# EasyEDA Pro project ProProject_ESP32-Gateway_2023-11-02.epro, schematic Schematic1_1
Create Date: 2022-03-22; Page Name: P1; Project Name: YuToo墨水屏时钟; Schematic Name: Schematic1_1; Update Date: 2022-10-05; Add into BOM: yes; Company: 深圳嘉立创科技发展有限公司; Convert to PCB: yes; Drawed: 嘉立创EDA; Page Size: A3; Part Number: JLCPCB-001; Reviewed: 嘉立创EDA; Version: V0.1
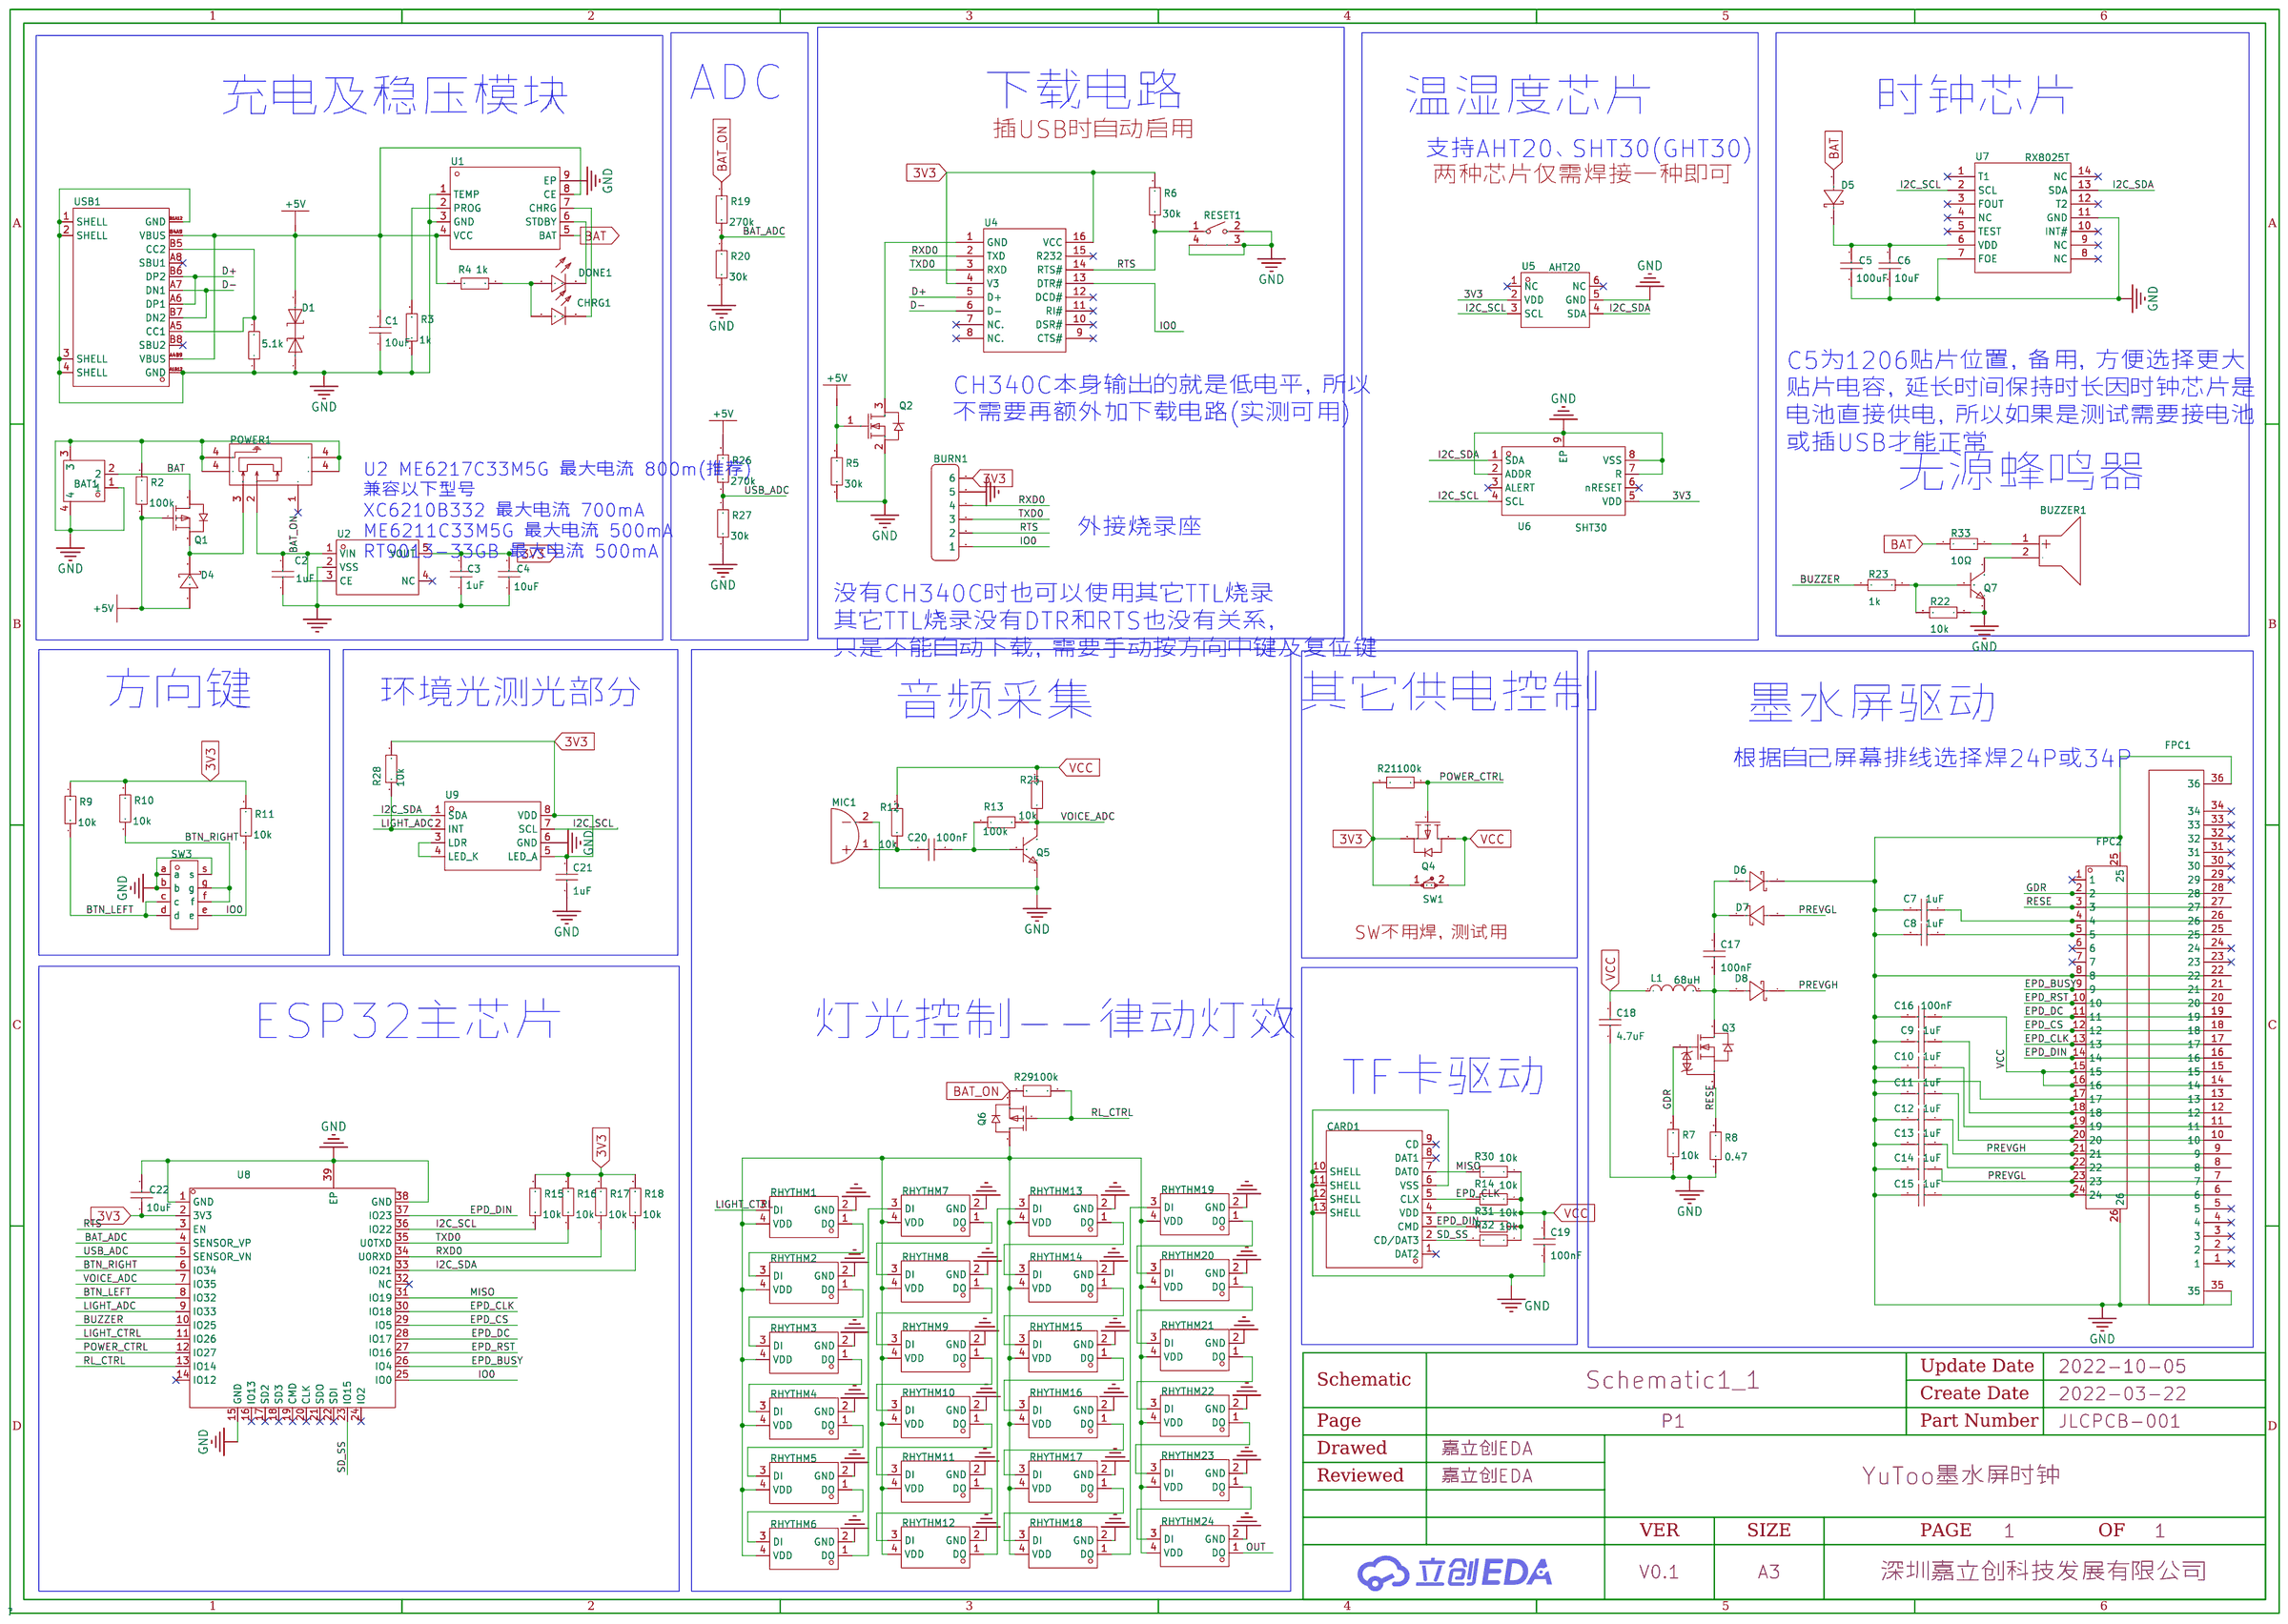
[diagram p3: schematic sheet]

## Parts
BAT1  -  [CONN-SMD_P2.00_M2016VS-02P]
BURN1  -  [HDR-1X6P-2.54]
BUZZER1  2700Hz  [BUZ-TH_BD9.0-P5.00-D0.6-FD]
C1  10uF  [C0805]
C2  1uF  [C0603]
C3  1uF  [C0603]
C4  10uF  [C0805]
C5  100uF  [C1206]
C6  10uF  [C0805]
C7  1uF  [C0603]
C8  1uF  [C0603]
C9  1uF  [C0603]
C10  1uF  [C0603]
C11  1uF  [C0603]
C12  1uF  [C0603]
C13  1uF  [C0603]
C14  1uF  [C0603]
C15  1uF  [C0603]
C16  100nF  [C0603]
C17  100nF  [C0603]
C18  4.7uF  [C0603]
C19  100nF  [C0603]
C20  100nF  [C0603]
C21  1uF  [C0603]
C22  10uF  [C0805]
CARD1  -  [TF-SMD_THD2528-11SD-GF]
CHRG1  -  [LED0603-R-RD]
D1  -  [SOD-523_L1.2-W0.8-LS1.6-BI]
D4  -  [SMA_L4.3-W2.6-LS5.1-RD]
D5  -  [SOD-123_L2.7-W1.6-LS3.7-RD-1]
D6  -  [SOD-123_L2.7-W1.6-LS3.7-RD-1]
D7  -  [SOD-123_L2.7-W1.6-LS3.7-RD-1]
D8  -  [SOD-123_L2.7-W1.6-LS3.7-RD-1]
DONE1  -  [LED0603-R-RD]
FPC1  -  [FPC-SMD_P0.50-34P_AFC07-S34ECC-00]
FPC2  -  [FPC-SMD_24P-L17.5-W5.4-P0.50]
L1  68uH  [IND-SMD_L4.0-W4.0]
MIC1  -  [MIC-TH_BD6.0-P1.90-D0.4-L]
POWER1  -  [SW-TH_MSK12C02]
Q1  -  [SOT-23_L2.9-W1.3-P1.90-LS2.4-BR]
Q2  -  [SOT-23_L2.9-W1.3-P1.90-LS2.4-BR]
Q3  -  [SOT-323_L2.0-W1.3-P1.30-LS2.1-BR]
Q4  -  [SOT-23_L2.9-W1.3-P1.90-LS2.4-BR]
Q5  S8050-J3Y  [SOT-23-3_L3.0-W1.7-P0.95-LS2.9-BR]
Q6  -  [SOT-23_L2.9-W1.3-P1.90-LS2.4-BR]
Q7  S8050-J3Y  [SOT-23-3_L3.0-W1.7-P0.95-LS2.9-BR]
R1  5.1k  [R0603]
R2  100k  [R0603]
R3  1k  [R0603]
R4  1k  [R0603]
R5  30k  [R0603]
R6  30k  [R0603]
R7  10k  [R0603]
R8  0.47  [R0603]
R9  10k  [R0603]
R10  10k  [R0603]
R11  10k  [R0603]
R12  10k  [R0603]
R13  100k  [R0603]
R14  10k  [R0603]
R15  10k  [R0603]
R16  10k  [R0603]
R17  10k  [R0603]
R18  10k  [R0603]
R19  270k  [R0603]
R20  30k  [R0603]
R21  100k  [R0603]
R22  10k  [R0603]
R23  1k  [R0603]
R25  10k  [R0603]
R26  270k  [R0603]
R27  30k  [R0603]
R28  10k  [R0603]
R29  100k  [R0603]
R30  10k  [R0603]
R31  10k  [R0603]
R32  10k  [R0603]
R33  10Ω  [R0603]
RESET1  -  [SW-SMD_L4.7-W3.5-P3.35-EH]
RHYTHM1  -  [LED-SMD_4P-L2.0-W2.0-TL_WS2812B-2020]
RHYTHM2  -  [LED-SMD_4P-L2.0-W2.0-TL_WS2812B-2020]
RHYTHM3  -  [LED-SMD_4P-L2.0-W2.0-TL_WS2812B-2020]
RHYTHM4  -  [LED-SMD_4P-L2.0-W2.0-TL_WS2812B-2020]
RHYTHM5  -  [LED-SMD_4P-L2.0-W2.0-TL_WS2812B-2020]
RHYTHM6  -  [LED-SMD_4P-L2.0-W2.0-TL_WS2812B-2020]
RHYTHM7  -  [LED-SMD_4P-L2.0-W2.0-TL_WS2812B-2020]
RHYTHM8  -  [LED-SMD_4P-L2.0-W2.0-TL_WS2812B-2020]
RHYTHM9  -  [LED-SMD_4P-L2.0-W2.0-TL_WS2812B-2020]
RHYTHM10  -  [LED-SMD_4P-L2.0-W2.0-TL_WS2812B-2020]
RHYTHM11  -  [LED-SMD_4P-L2.0-W2.0-TL_WS2812B-2020]
RHYTHM12  -  [LED-SMD_4P-L2.0-W2.0-TL_WS2812B-2020]
RHYTHM13  -  [LED-SMD_4P-L2.0-W2.0-TL_WS2812B-2020]
RHYTHM14  -  [LED-SMD_4P-L2.0-W2.0-TL_WS2812B-2020]
RHYTHM15  -  [LED-SMD_4P-L2.0-W2.0-TL_WS2812B-2020]
RHYTHM16  -  [LED-SMD_4P-L2.0-W2.0-TL_WS2812B-2020]
RHYTHM17  -  [LED-SMD_4P-L2.0-W2.0-TL_WS2812B-2020]
RHYTHM18  -  [LED-SMD_4P-L2.0-W2.0-TL_WS2812B-2020]
RHYTHM19  -  [LED-SMD_4P-L2.0-W2.0-TL_WS2812B-2020]
RHYTHM20  -  [LED-SMD_4P-L2.0-W2.0-TL_WS2812B-2020]
RHYTHM21  -  [LED-SMD_4P-L2.0-W2.0-TL_WS2812B-2020]
RHYTHM22  -  [LED-SMD_4P-L2.0-W2.0-TL_WS2812B-2020]
RHYTHM23  -  [LED-SMD_4P-L2.0-W2.0-TL_WS2812B-2020]
RHYTHM24  -  [LED-SMD_4P-L2.0-W2.0-TL_WS2812B-2020]
SW1  -  [SW_Hand_Weld_JX]
SW3  -  [SW-SMD_TM-1011A]
U1  -  [ESOP-8_L4.9-W3.9-P1.27-LS6.0-BL-EP]
U2  -  [SOT-23-5_L3.0-W1.7-P0.95-LS2.8-BR]
U4  -  [SOP-16_L10.0-W3.9-P1.27-LS6.0-BL]
U5  AHT20  [SENSOR-SMD_L3.0-W3.0-P1.00-BR]
U6  SHT30  [DFN-8_L2.5-W2.5-P0.50-BL-EP]
U7  RX8025T  [SOIC-14_L10.0-W5.5-P1.27-LS7.8-BL]
U8  -  [WIRELM-SMD_ESP32-S]
U9  -  [SENSOR-SMD_L3.9-W2.4-P0.95-BL]
USB1  -  [USB-SMD_TYPE-611S-T3]

## Library data of the parts
BAT1 = M2016VS-02P: 参考系列:-;间距:2mm;插针结构:1x2P;排数:1;每排PIN数:2;行距:-;公母:公型插针;安装方式:立贴;额定电流:3A;工作温度范围:-25~+85;; LCSC Part Name: 针座 HY 间距2.0mm 2P 立式贴片; Supplier Part: C541769; Manufacturer: XFCN(台湾兴飞); Supplier Footprint: SMD,P=2mm; Datasheet: https://atta.szlcsc.com/upload/public/pdf/source/20200518/C541769_639F8BBB33AD149B610394A13D0429D3.pdf; Supplier: LCSC; Pitch: 2mm; Pins Structure: 1x2P; Number of Rows: 1; Number of PINs Per Row: 2; Gender: 公型插针; Mounting Style: 立贴; Current Rating (Max): 3A; Operating Temperature Range: -25~+85; JLCPCB Part Class: Extended Part
BURN1 = Header-1X6P-2.54: Pin Type: IN; Supplier: LCSC; Manufacturer: ReliaPro; Manufacturer Part: Header-Female-2.54_1x4; Supplier Part: C124413; JLCPCB Part Class: Extended Part
BUZZER1 = YS-MBZ9055DYB03: 驱动方式:有源(内含驱动线路);构造类型:电磁式;额定电压:3V;工作电压:2V~5V;频率:2700Hz;声压(SPL):85dB@3V,10cm;直径(D):9mm;高度:5.7mm;; LCSC Part Name: 电磁式有源一体蜂鸣器3V; Supplier Part: C409835; Manufacturer: Fengming(锋鸣电子); Supplier Footprint: 插件,P=5mm; Datasheet: https://atta.szlcsc.com/upload/public/pdf/source/20191217/C409835_3DB20B54A6DEE27B151317CCE90A5EA8.pdf; Supplier: LCSC; Oscillator Circuit: 有源(内含驱动线路); Technology Type: 电磁式; Rated Voltage: 3V; Operating Voltage: 2V~5V; Sound Pressure Level (SPL): 85dB@3V,10cm; Diameter (φD): 9mm; Height: 5.7mm; JLCPCB Part Class: Extended Part
C1 C4 C6 C22 = CC0805KRX7R9BB104: 容值:100nF;精度:±10%;额定电压:50V;温度系数:X7R;; LCSC Part Name: 100nF ±10% 50V; Supplier Part: C15850; Manufacturer: YAGEO(国巨); Supplier Footprint: 0805; JLCPCB Part Class: Basic Part; Datasheet: https://atta.szlcsc.com/upload/public/pdf/source/20151026/1457707504898.pdf; Supplier: LCSC; Tolerance: ±10%; Voltage Rated: 50V; Temperature Coefficient: X7R
C2 C3 C7-C15 C21 = CC0805KRX7R9BB104: 容值:100nF;精度:±10%;额定电压:50V;温度系数:X7R;; LCSC Part Name: 100nF ±10% 50V; Supplier Part: C15849; Manufacturer: YAGEO(国巨); Supplier Footprint: 0603; JLCPCB Part Class: Basic Part; Datasheet: https://atta.szlcsc.com/upload/public/pdf/source/20151026/1457707504898.pdf; Supplier: LCSC; Tolerance: ±10%; Voltage Rated: 50V; Temperature Coefficient: X7R
C5 = CC0805KRX7R9BB104: 容值:100nF;精度:±10%;额定电压:50V;温度系数:X7R;; LCSC Part Name: 100nF ±10% 50V; Supplier Part: C49678; Manufacturer: YAGEO(国巨); Supplier Footprint: 0805; JLCPCB Part Class: Basic Part; Datasheet: https://atta.szlcsc.com/upload/public/pdf/source/20151026/1457707504898.pdf; Supplier: LCSC; Tolerance: ±10%; Voltage Rated: 50V; Temperature Coefficient: X7R
C16 C20 = CC0805KRX7R9BB104: 容值:100nF;精度:±10%;额定电压:50V;温度系数:X7R;; LCSC Part Name: 100nF ±10% 50V; Supplier Part: C14663; Manufacturer: YAGEO(国巨); Supplier Footprint: 0603; JLCPCB Part Class: Basic Part; Datasheet: https://atta.szlcsc.com/upload/public/pdf/source/20151026/1457707504898.pdf; Supplier: LCSC; Tolerance: ±10%; Voltage Rated: 50V; Temperature Coefficient: X7R
C17 C19 = CC0805KRX7R9BB104: 容值:100nF;精度:±10%;额定电压:50V;温度系数:X7R;; LCSC Part Name: 100nF ±10% 50V; Supplier Part: C14663; Manufacturer: YAGEO(国巨); Supplier Footprint: 0805; JLCPCB Part Class: Basic Part; Datasheet: https://atta.szlcsc.com/upload/public/pdf/source/20151026/1457707504898.pdf; Supplier: LCSC; Tolerance: ±10%; Voltage Rated: 50V; Temperature Coefficient: X7R
C18 = CC0805KRX7R9BB104: 容值:100nF;精度:±10%;额定电压:50V;温度系数:X7R;; LCSC Part Name: 100nF ±10% 50V; Supplier Part: C19666; Manufacturer: YAGEO(国巨); Supplier Footprint: 0603; JLCPCB Part Class: Basic Part; Datasheet: https://atta.szlcsc.com/upload/public/pdf/source/20151026/1457707504898.pdf; Supplier: LCSC; Tolerance: ±10%; Voltage Rated: 50V; Temperature Coefficient: X7R
CARD1 = THD2528-11SD-GF: 卡连接方式:自弹式;卡类型:MicroSD卡(TF卡);连接器类型:卡座;本体最大高度:2mm;工作温度范围:-;; LCSC Part Name: 自弹式 MicroSD卡(TF卡) 卡座 外焊; Supplier Part: C283232; Manufacturer: THD(台华达); Supplier Footprint: SMD; Datasheet: https://atta.szlcsc.com/upload/public/pdf/source/20190329/C283232_532F94C79FB51CC42613BF324E8B5690.pdf; Supplier: LCSC; Card Connection Mode: 自弹式; Card Type: MicroSD卡(TF卡); Connector Type: 卡座; Maximum Body Height: 2mm; JLCPCB Part Class: Extended Part
CHRG1 = 19-217/R6C-AL1M2VY/3T: 发光颜色:红灯;二极管配置:-;透镜颜色:无色透明;主波长:617.5nm;峰值波长:632nm;色温:-;光通量(25时):-;测试电流:5mA;正向电压(VF):2.2V;发光强度:28.5mcd;功率:60mW;发光角度:120°;安装方式:-;工作温度:-40~+85;; LCSC Part Name: 0603 红灯; Supplier Part: C2286; Manufacturer: EVERLIGHT(台湾亿光); Supplier Footprint: 0603; Datasheet: https://atta.szlcsc.com/upload/public/pdf/source/20160507/1462613613821.pdf; Supplier: LCSC; Emitted Color: 红灯; Lens Color: 无色透明; Dominant Wavelength: 617.5nm; Peak Wavelength: 632nm; Forward Current: 5mA; Forward Voltage (VF): 2.2V; Luminous Intensity: 28.5mcd; Power Dissipation: 60mW; Viewing Angle: 120°; Operating Temperature: -40~+85; JLCPCB Part Class: Extended Part
D1 = ESD5Z5.0VC: 极性:双向;反向截止电压(Vrwm):5V@(最大值);击穿电压(最小值):5.6V;峰值脉冲电流(Ipp)@10/1000s:4A;最大钳位电压:12V;; LCSC Part Name: 双向 5V@(最大值); Supplier Part: C261278; Manufacturer: TC(德昌); Supplier Footprint: SOD-523; Datasheet: https://atta.szlcsc.com/upload/public/pdf/source/20180801/C261278_4236068C2349B5255C3720AC1205D526.pdf; Supplier: LCSC; Polarity: 双向; Reverse Stand-Off Voltage (Vrwm): 5V@(最大值); Breakdown Voltage (Min): 5.6V; Peak Pulse Current (Ipp)@10/1000μs: 4A; Maximum Clamping Voltage: 12V; JLCPCB Part Class: Extended Part
D4 = SS34: 直流反向耐压(Vr):40V;平均整流电流(Io):3A;正向压降(Vf):550mV@3A;; LCSC Part Name: 40V 3A 550mV@3A (SMA打扁); Supplier Part: C355267; Manufacturer: SINO-IC(光宇睿芯); Supplier Footprint: SMA; Datasheet: https://atta.szlcsc.com/upload/public/pdf/source/20190731/C355267_DFDD47B37D7A4339E7036B819780E55C.pdf; Supplier: LCSC; Reverse Voltage (Vr): 40V; Average Rectified Current (Io): 3A; Forward Voltage (Vf@If): 550mV@3A; JLCPCB Part Class: Extended Part
D5-D8 = MBR0530_C699108: 直流反向耐压(Vr):30V;平均整流电流(Io):500mA;正向压降(Vf):550mV@500mA;; LCSC Part Name: 30V 500mA 550mV@500mA; Supplier Part: C699108; Manufacturer: YANGJIE(扬杰); Manufacturer Part: MBR0530; Supplier Footprint: SOD-123; Datasheet: https://atta.szlcsc.com/upload/public/pdf/source/20200709/C699108_94C8F1A54679DD603C9696C8694A3BC2.pdf; Supplier: LCSC; Reverse Voltage (Vr): 30V; Average Rectified Current (Io): 500mA; Forward Voltage (Vf@If): 550mV@500mA; JLCPCB Part Class: Extended Part
DONE1 = 19-217/R6C-AL1M2VY/3T: 发光颜色:绿灯;二极管配置:-;透镜颜色:无色透明;主波长:617.5nm;峰值波长:632nm;色温:-;光通量(25时):-;测试电流:5mA;正向电压(VF):2.2V;发光强度:28.5mcd;功率:60mW;发光角度:120°;安装方式:-;工作温度:-40~+85;; LCSC Part Name: 0603 红灯; Supplier Part: C72043; Manufacturer: EVERLIGHT(台湾亿光); Supplier Footprint: 0603; Datasheet: https://atta.szlcsc.com/upload/public/pdf/source/20160507/1462613613821.pdf; Supplier: LCSC; Emitted Color: 绿灯; Lens Color: 无色透明; Dominant Wavelength: 617.5nm; Peak Wavelength: 632nm; Forward Current: 5mA; Forward Voltage (VF): 2.2V; Luminous Intensity: 28.5mcd; Power Dissipation: 60mW; Viewing Angle: 120°; Operating Temperature: -40~+85; JLCPCB Part Class: Extended Part
FPC1 = AFC07-S34ECC-00: 间距:0.5mm;触点数量:34;锁定特性:抽屉式;安装类型:卧贴;触点类型:上接;; LCSC Part Name: 0.5mm P数:34 抽屉式 上接; Supplier Part: C262252; Manufacturer: JS(钜硕电子); Supplier Footprint: SMD,P=0.5mm; Datasheet: https://atta.szlcsc.com/upload/public/pdf/source/20180814/C262252_C52039445B51FAA4B2989BDA41C3583D.pdf; Supplier: LCSC; Pitch: 0.5mm; Number of Contacts: 34; Locking Feature: 抽屉式; Mounting Type: 卧贴; Contact Type: 上接; Height Above Board: 2mm; FFC, FCB Thickness: 0.3mm; JLCPCB Part Class: Extended Part
FPC2 = AFC07-S24ECC-00: 间距:0.5mm;触点数量:24;锁定特性:抽屉式;安装类型:卧贴;触点类型:上接;; LCSC Part Name: 0.5mm P数:24 抽屉式 上接; Supplier Part: C11092; Manufacturer: JS(钜硕电子); Supplier Footprint: SMD,P=0.5mm; Datasheet: https://atta.szlcsc.com/upload/public/pdf/source/20151024/1457707484416.pdf; Supplier: LCSC; Pitch: 0.5mm; Number of Contacts: 24; Locking Feature: 抽屉式; Mounting Type: 卧贴; Contact Type: 上接; Height Above Board: 2mm; FFC, FCB Thickness: 0.3mm; JLCPCB Part Class: Extended Part
L1 = CR4020-680M: 电感值:68uH;精度:±20%;额定电流:-;直流电阻(DCR):-;; LCSC Part Name: 68uH ±20%; Supplier Part: C520318; Manufacturer: ceaiya(柯爱亚); Supplier Footprint: SMD; Datasheet: https://atta.szlcsc.com/upload/public/pdf/source/20200424/C520276_8639ABF18B4A41322D74F24464FD005B.pdf; Supplier: LCSC; Tolerance: ±20%; JLCPCB Part Class: Extended Part
MIC1 = GMI6027P-2C30DB: LCSC Part Name: 全指向双电容6.0*2.7mm 1.5V-10V 灵敏度-30db 低阻抗 针脚; Supplier Part: C233898; Manufacturer: INGHAi(赢海); Supplier Footprint: Through Hole; Datasheet: https://atta.szlcsc.com/upload/public/pdf/source/20200113/C233898_D8BE2FE83B1F65BC1FBE3EFA130F0DFD.pdf; Supplier: LCSC; JLCPCB Part Class: Extended Part
POWER1 = MSK12C02: LCSC Part Name: 两档侧拨贴片 7脚 拨动 白柄 柄长1.5mm,带定位柱; Supplier Part: C431540; Manufacturer: SHOU HAN(首韩); Supplier Footprint: SMD; JLCPCB Part Class: Extended Part; Datasheet: https://atta.szlcsc.com/upload/public/pdf/source/20190925/C431540_89155AEF0758B9AD1B2D805F83FB12E3.pdf; Supplier: LCSC
Q1 Q4 Q6 = SI2305: 类型:P沟道;漏源电压(Vdss):20V;连续漏极电流(Id):4.1A;功率(Pd):1.25W;导通电阻(RDS(on)@Vgs,Id):52m@4.5V,4.1A;阈值电压(Vgs(th)@Id):1V@250A;; LCSC Part Name: P沟道 20V 4.1A; Supplier Part: C344006; Manufacturer: BORN伯恩半导体; Supplier Footprint: SOT-23; Datasheet: https://atta.szlcsc.com/upload/public/pdf/source/20181211/C344006_B14C481D34E4DBCC9865316765F4D8FD.pdf; Supplier: LCSC; Type: P沟道; Drain Source Voltage (Vdss): 20V; Continuous Drain Current (Id): 4.1A; Power Dissipation (Pd): 1.25W; Drain Source On Resistance (RDS(on)@Vgs,Id): 52m@4.5V,4.1A; Gate Threshold Voltage (Vgs(th)@Id): 1V@250A; JLCPCB Part Class: Extended Part
Q2 = AO3402: LCSC Part Name: 场效应管(MOSFET); Supplier Part: C2938369; Manufacturer: GOODWORK(固得沃克); Supplier Footprint: SOT23; JLCPCB Part Class: Extended Part; Datasheet: https://atta.szlcsc.com/upload/public/pdf/source/20211229/104159C48197010484F8CEA4AB274E1B.pdf; Supplier: LCSC
Q3 = SI1308EDL-T1-GE3: 类型:N沟道;漏源电压(Vdss):30V;连续漏极电流(Id):1.4A;功率(Pd):400mW;导通电阻(RDS(on)@Vgs,Id):132m@10V,1.4A;阈值电压(Vgs(th)@Id):1.5V@250A;; LCSC Part Name: N沟道 30V 1.4A; Supplier Part: C469327; Manufacturer: VISHAY(威世); Supplier Footprint: SOT-323; Datasheet: https://atta.szlcsc.com/upload/public/pdf/source/20191217/C469327_3FE8BCBB7604A1B1F6779A1D9DD725BB.pdf; Supplier: LCSC; Type: N沟道; Drain Source Voltage (Vdss): 30V; Continuous Drain Current (Id): 1.4A; Power Dissipation (Pd): 400mW; Drain Source On Resistance (RDS(on)@Vgs,Id): 132m@10V,1.4A; Gate Threshold Voltage (Vgs(th)@Id): 1.5V@250A; JLCPCB Part Class: Extended Part
Q5 Q7 = S8050-J3Y: Pin Type: IN; Supplier: LCSC; Supplier Part: C364312; Manufacturer: (MDD) Jiangsu Yutai Elec; JLCPCB Part Class: Extended Part
R1 = TR0603B10K0P0525Z: 电阻类型:薄膜电阻;阻值:10k;精度:±0.1%;功率:100mW;温度系数:±25ppm/;最大工作电压:75V;工作温度范围:-55~+155;; LCSC Part Name: 10k ±0.1% 100mW; Supplier Part: C23186; Manufacturer: EVER OHMS(天二科技); Supplier Footprint: 0603; JLCPCB Part Class: Extended Part; Datasheet: https://atta.szlcsc.com/upload/public/pdf/source/20190415/C188363_433BF05B6FB8F7A0F5F35A3E4390C55A.pdf; Supplier: LCSC; Type: 薄膜电阻; Tolerance: ±0.1%; Power(Watts): 100mW; Temperature Coefficient: ±25ppm/; Overload Voltage (Max): 75V; Operating Temperature Range: -55~+155
R2 R13 = TR0603B10K0P0525Z: 电阻类型:薄膜电阻;阻值:10k;精度:±0.1%;功率:100mW;温度系数:±25ppm/;最大工作电压:75V;工作温度范围:-55~+155;; LCSC Part Name: 10k ±0.1% 100mW; Supplier Part: C25803; Manufacturer: EVER OHMS(天二科技); Supplier Footprint: 0603; JLCPCB Part Class: Extended Part; Datasheet: https://atta.szlcsc.com/upload/public/pdf/source/20190415/C188363_433BF05B6FB8F7A0F5F35A3E4390C55A.pdf; Supplier: LCSC; Type: 薄膜电阻; Tolerance: ±0.1%; Power(Watts): 100mW; Temperature Coefficient: ±25ppm/; Overload Voltage (Max): 75V; Operating Temperature Range: -55~+155
R3 R4 R23 = TR0603B10K0P0525Z: 电阻类型:薄膜电阻;阻值:10k;精度:±0.1%;功率:100mW;温度系数:±25ppm/;最大工作电压:75V;工作温度范围:-55~+155;; LCSC Part Name: 10k ±0.1% 100mW; Supplier Part: C21190; Manufacturer: EVER OHMS(天二科技); Supplier Footprint: 0603; JLCPCB Part Class: Extended Part; Datasheet: https://atta.szlcsc.com/upload/public/pdf/source/20190415/C188363_433BF05B6FB8F7A0F5F35A3E4390C55A.pdf; Supplier: LCSC; Type: 薄膜电阻; Tolerance: ±0.1%; Power(Watts): 100mW; Temperature Coefficient: ±25ppm/; Overload Voltage (Max): 75V; Operating Temperature Range: -55~+155
R5 R6 R20 R27 = TR0603B10K0P0525Z: 电阻类型:薄膜电阻;阻值:10k;精度:±0.1%;功率:100mW;温度系数:±25ppm/;最大工作电压:75V;工作温度范围:-55~+155;; LCSC Part Name: 10kΩ ±0.1% 100mW; Supplier Part: C22984; Manufacturer: EVER OHMS(天二科技); Supplier Footprint: 0603; JLCPCB Part Class: Extended Part; Datasheet: https://atta.szlcsc.com/upload/public/pdf/source/20190415/C188363_433BF05B6FB8F7A0F5F35A3E4390C55A.pdf; Supplier: LCSC; Type: 薄膜电阻; Tolerance: ±0.1%; Power(Watts): 100mW; Temperature Coefficient: ±25ppm/; Overload Voltage (Max): 75V; Operating Temperature Range: -55~+155
R7 R9-R12 R14-R18 R22 R25 R28 R30-R32 = TR0603B10K0P0525Z: 电阻类型:薄膜电阻;阻值:10k;精度:±0.1%;功率:100mW;温度系数:±25ppm/;最大工作电压:75V;工作温度范围:-55~+155;; LCSC Part Name: 10k ±0.1% 100mW; Supplier Part: C188363; Manufacturer: EVER OHMS(天二科技); Supplier Footprint: 0603; JLCPCB Part Class: Extended Part; Datasheet: https://atta.szlcsc.com/upload/public/pdf/source/20190415/C188363_433BF05B6FB8F7A0F5F35A3E4390C55A.pdf; Supplier: LCSC; Type: 薄膜电阻; Tolerance: ±0.1%; Power(Watts): 100mW; Temperature Coefficient: ±25ppm/; Overload Voltage (Max): 75V; Operating Temperature Range: -55~+155
R8 = TR0603B10K0P0525Z: 电阻类型:薄膜电阻;阻值:10k;精度:±0.1%;功率:100mW;温度系数:±25ppm/;最大工作电压:75V;工作温度范围:-55~+155;; LCSC Part Name: 10k ±0.1% 100mW; Supplier Part: C103895; Manufacturer: EVER OHMS(天二科技); Supplier Footprint: 0603; JLCPCB Part Class: Extended Part; Datasheet: https://atta.szlcsc.com/upload/public/pdf/source/20190415/C188363_433BF05B6FB8F7A0F5F35A3E4390C55A.pdf; Supplier: LCSC; Type: 薄膜电阻; Tolerance: ±0.1%; Power(Watts): 100mW; Temperature Coefficient: ±25ppm/; Overload Voltage (Max): 75V; Operating Temperature Range: -55~+155
R19 R26 = TR0603B10K0P0525Z: 电阻类型:薄膜电阻;阻值:10k;精度:±0.1%;功率:100mW;温度系数:±25ppm/;最大工作电压:75V;工作温度范围:-55~+155;; LCSC Part Name: 10kΩ ±0.1% 100mW; Supplier Part: C22965; Manufacturer: EVER OHMS(天二科技); Supplier Footprint: 0603; JLCPCB Part Class: Extended Part; Datasheet: https://atta.szlcsc.com/upload/public/pdf/source/20190415/C188363_433BF05B6FB8F7A0F5F35A3E4390C55A.pdf; Supplier: LCSC; Type: 薄膜电阻; Tolerance: ±0.1%; Power(Watts): 100mW; Temperature Coefficient: ±25ppm/; Overload Voltage (Max): 75V; Operating Temperature Range: -55~+155
R21 R29 = TR0603B10K0P0525Z: 电阻类型:薄膜电阻;阻值:10k;精度:±0.1%;功率:100mW;温度系数:±25ppm/;最大工作电压:75V;工作温度范围:-55~+155;; LCSC Part Name: 10kΩ ±0.1% 100mW; Supplier Part: C25803; Manufacturer: EVER OHMS(天二科技); Supplier Footprint: 0603; JLCPCB Part Class: Extended Part; Datasheet: https://atta.szlcsc.com/upload/public/pdf/source/20190415/C188363_433BF05B6FB8F7A0F5F35A3E4390C55A.pdf; Supplier: LCSC; Type: 薄膜电阻; Tolerance: ±0.1%; Power(Watts): 100mW; Temperature Coefficient: ±25ppm/; Overload Voltage (Max): 75V; Operating Temperature Range: -55~+155
R33 = 0603WAF100JT5E: 电阻类型:厚膜电阻;阻值:10Ω;精度:±1%;功率:100mW;; LCSC Part Name: 10Ω ±1% 100mW; Supplier Part: C22859; Manufacturer: UNI-ROYAL(厚声); Supplier Footprint: 0603; JLCPCB Part Class: Basic Part; Datasheet: https://atta.szlcsc.com/upload/public/pdf/source/20200306/C422600_1E6D84923E4A46A82E41ADD87F860B5C.pdf; Supplier: LCSC; Type: 厚膜电阻; Tolerance: ±1%; Power(Watts): 100mW; Temperature Coefficient: ±400ppm/℃; Overload Voltage (Max): 75V; Operating Temperature Range: -55℃~+155℃
RESET1 = GT-TC018B-H0375-L1: 触点电流:50mA;额定电压(DC):12V;绝缘电阻:100MΩ;电路结构:单刀单掷;安装方式:卧贴;按钮形状:矩形按钮;按钮/盖帽颜色:黑色;带灯:无;作用力:250gf@±30gf;机械寿命:100000;工作温度:-30~+85;引脚样式:SMD接片;开关长度:4.7mm;开关宽度:1.9mm;开关高度:3.75mm;带支架:否;; LCSC Part Name: 243.75侧按轻触开关; Supplier Part: C2762970; Manufacturer: G-Switch(品赞); Supplier Footprint: SMD; JLCPCB Part Class: Extended Part; Datasheet: https://atta.szlcsc.com/upload/public/pdf/source/20201201/C963235_1379E8FB9A9D5A830B16F6A18B8D18DC.pdf; Supplier: LCSC; Contact Current: 50mA; Voltage Rating (DC): 12V; Insulation Resistance: 100MΩ; Circuit: 单刀单掷; Mounting Style: 卧贴; Actuator Style: 矩形按钮; Actuator/Cap Color: 黑色; With Lamp: 无; Operating Force: 250gf@±30gf; Mechanical Life: 100000; Operating Temperature: -30~+85; Pin Style: SMD接片; Switch Length: 4.7mm; Switch Width: 1.9mm; Switch Height: 3.75mm; Strike Gundam: 否
RHYTHM1-RHYTHM24 = WS2812B-2020: 发光颜色:RGB三色;二极管配置:-;透镜颜色:-;主波长:470.4nm；622.5nm；515.6nm;峰值波长:-;色温:-;光通量(25时):-;测试电流:12mA;正向电压(VF):-;发光强度:160mcd；200mcd；600mcd;功率:-;发光角度:-;安装方式:-;工作温度:-;; LCSC Part Name: RGB三色; Supplier Part: C965555; Manufacturer: worldsemi; Supplier Footprint: SMD,2x2mm; Datasheet: https://atta.szlcsc.com/upload/public/pdf/source/20201203/C965555_5C919C4B6231E6ADE06011FB0D94282B.pdf; Supplier: LCSC; Emitted Color: RGB三色; Dominant Wavelength: 470.4nm；622.5nm；515.6nm; Forward Current: 12mA; Luminous Intensity: 160mcd；200mcd；600mcd; JLCPCB Part Class: Extended Part
SW1 = SW_Hand_Weld_JX
SW3 = TM-1011A: 蓝牙音响波轮开关 3挡拨轮开关; LCSC Part Name: 蓝牙音响波轮开关 3挡拨轮开关; Supplier Part: C318960; Manufacturer: XKB Connectivity(中国星坤); Supplier Footprint: SMD; Datasheet: https://atta.szlcsc.com/upload/public/pdf/source/20211015/0F19BB59F8C8EF90A3009BEE019EE4D4.pdf; Supplier: LCSC; JLCPCB Part Class: Extended Part
U1 = TP4056: 充电电池的类型:-;电池单元组数:-;最大充电电流:-;充满的电池组电压:-;最大供应电压:-;; Supplier Part: C725790; Manufacturer: UMW(友台半导体); Supplier Footprint: ESOP-8; Datasheet: https://atta.szlcsc.com/upload/public/pdf/source/20211011/37515E71BA298E23D23475482C49633D.pdf; Supplier: LCSC; JLCPCB Part Class: Extended Part
U2 = ME6217C33M5G: 输出类型:固定;输出极性:正;输出通道数:1;最大输入电压:7V;输出电压:3.3V;压差:180mV@(300mA);静态电流(地电流):-;输出电流:800mA;电源纹波抑制比(PRSS):65dB@(1kHz);; LCSC Part Name: Vin=7V Vout=3.3V 800mA 65dB@(1kHz); Supplier Part: C427602; Manufacturer: MICRONE(南京微盟); Supplier Footprint: SOT-23-5; Datasheet: https://atta.szlcsc.com/upload/public/pdf/source/20190910/C427602_D4B9162A2E9D9EF57C60010DFDECEF37.pdf; Supplier: LCSC; Output Type: 固定; Output Polarity: 正; Number of Outputs: 1; Maximum Input Voltage: 7V; Output Voltage: 3.3V; Dropout Voltage: 180mV@(300mA); Output Current: 800mA; Power Supply Rejection Ratio (PRSS): 65dB@(1kHz); JLCPCB Part Class: Extended Part
U4 = CH340C: 类型:Transceiver;协议类别:USB 2.0;驱动器/接收器数:-;数据速率:2Mbps;; Supplier Part: C84681; Manufacturer: WCH(南京沁恒); Supplier Footprint: SOP-16_150mil; Datasheet: https://atta.szlcsc.com/upload/public/pdf/source/20200819/C84681_ADBED554CE321879DBD6B1D06488689C.pdf; Supplier: LCSC; Type: Transceiver; Protocol: USB 2.0; Data Rate: 2Mbps; Supply Voltage: 3.3V, 5V; JLCPCB Part Class: Extended Part
U5 = AHT20_C2757850: Supplier Part: C2757850; Manufacturer: 广州奥松; Supplier Footprint: SMD; Datasheet: https://atta.szlcsc.com/upload/public/pdf/source/20200407/C503357_487829B2F97386053400E2E73B0ABB4D.pdf; Supplier: LCSC; JLCPCB Part Class: Extended Part
U6 = SHT30-DIS-B10KS: 传感器类型:-;输出类型:-;温度范围:-;湿度范围:-;精度:-;; LCSC Part Name: SHT30-DIS; Supplier Part: C2687423; Manufacturer: Sensirion(瑞士盛思锐); Supplier Footprint: DFN-8; Datasheet: https://atta.szlcsc.com/upload/public/pdf/source/20210120/C2687423_31DB3FACC3E95675626B9DEF500B4777.pdf; Supplier: LCSC; JLCPCB Part Class: Extended Part
U7 = RX8025T-UB: 时钟芯片类型:Clock/Calendar;存储器容量:-;时间格式:HH:MM:SS;日期格式:YY-MM-DD;接口类型:I2C;; LCSC Part Name: RX8025T-UB(X1B000281000400); Supplier Part: C17353; Manufacturer: EPSON(爱普生); Supplier Footprint: SOP-14_208mil; Datasheet: https://atta.szlcsc.com/upload/public/pdf/source/20160318/1458266986300.pdf; Supplier: LCSC; Type: Clock/Calendar; Features: Alarm; Time Format: HH:MM:SS; Date Format: YY-MM-DD; Interface: I2C; Voltage - Supply: 1.8V ~ 5.5V; Current - Timekeeping (Max): 3.4A @ 5V; JLCPCB Part Class: Extended Part
U8 = ESP32-S_1: LCSC Part Name: ESP32-S; Supplier Part: C277944; Manufacturer: Ai-Thinker(安信可); Manufacturer Part: ESP32-S; Supplier Footprint: SMD Module; Datasheet: https://atta.szlcsc.com/upload/public/pdf/source/20211217/F4BEA33E732D6002D10DAED85BBCB52B.pdf; Supplier: LCSC; JLCPCB Part Class: Extended Part
U9 = LTR-553ALS-01: 类型:-;波长:-;近距离探测:-;输出类型:-;; LCSC Part Name: 三合一光传感器; Supplier Part: C492375; Manufacturer: LITEON(台湾光宝); Supplier Footprint: SMD; Supplier: LCSC; JLCPCB Part Class: Extended Part
USB1 = TYPE-611S-T3: 连接器类型:Type-C;标准:-;公母:母座;触点数量:16;端口数量:1;安装方式:卧贴;额定电流 - 电源:3A;工作温度范围:-25~+85;; LCSC Part Name: Type-C 母座 卧贴 端子镀金8.94x7.3x3.16mm; Supplier Part: C2874595; Manufacturer: Yuandi(台湾元迪); Supplier Footprint: SMD; JLCPCB Part Class: Extended Part; Datasheet: https://atta.szlcsc.com/upload/public/pdf/source/20210810/BECE640E8A6D64F3BF313A26DC5F68B7.pdf; Supplier: LCSC; Connector Type: Type-C; Gender: 母座; Number of Contacts: 16; Number of Ports: 1; Mounting Style: 卧贴; Current Rating - Power (Max): 3A; Operating Temperature Range: -25~+85

## Nets
3V3: BURN1.6 C3.2 C4.2 C21.1 C22.1 Q4.2(S) R6.2 R9.2 R10.2 R11.2 R15.2 R16.2 R17.2 R18.2 R21.2 R28.1 SW1.1 U2.5(VOUT) U4.4(V3) U4.16(VCC) U5.2(VDD) U6.5(VDD) U8.2(3V3) U9.5(LED A) U9.8(VDD)
+5V: C1.2 D1.2 D4.2(A) Q1.1(G) Q2.1(G) R2.1 R4.2 R5.2 R26.2 U1.4(VCC) U1.8(CE) USB1.A4B9(VBUS) USB1.B4A9(VBUS)
GND: BAT1.1 BAT1.3 BAT1.4 BURN1.5 C1.1 C2.1 C3.1 C4.1 C5.1 C6.1 C7.2 C8.2 C9.2 C10.2 C11.2 C12.2 C13.2 C14.2 C15.2 C16.2 C18.2 C19.2 C21.2 C22.2 CARD1.6(VSS) CARD1.10(SHELL) CARD1.11(SHELL) CARD1.12(SHELL) CARD1.13(SHELL) D1.1 D6.1(K) FPC1.13 FPC1.22 FPC1.35 FPC1.36 FPC2.8 FPC2.17 FPC2.25 FPC2.26 MIC1.2 POWER1.4 Q2.2(S) Q5.2(E) Q7.2(E) R1.1 R2.2 R3.1 R5.1 R7.1 R8.1 R20.1 R22.1 R27.1 RESET1.2 RESET1.3 RESET1.4 RHYTHM1.2(GND) RHYTHM2.2(GND) RHYTHM3.2(GND) RHYTHM4.2(GND) RHYTHM5.2(GND) RHYTHM6.2(GND) RHYTHM7.2(GND) RHYTHM8.2(GND) RHYTHM9.2(GND) RHYTHM10.2(GND) RHYTHM11.2(GND) RHYTHM12.2(GND) RHYTHM13.2(GND) RHYTHM14.2(GND) RHYTHM15.2(GND) RHYTHM16.2(GND) RHYTHM17.2(GND) RHYTHM18.2(GND) RHYTHM19.2(GND) RHYTHM20.2(GND) RHYTHM21.2(GND) RHYTHM22.2(GND) RHYTHM23.2(GND) RHYTHM24.2(GND) SW3.a SW3.b SW3.s U1.1(TEMP) U1.3(GND) U1.9(EP) U2.2(VSS) U5.5(GND) U6.2(ADDR) U6.7(R) U6.8(VSS) U6.9(EP) U7.7(FOE) U7.11(GND) U8.1(GND) U8.15(GND) U8.38(GND) U8.39(EP) U9.6(GND) USB1.1(SHELL) USB1.2(SHELL) USB1.3(SHELL) USB1.4(SHELL) USB1.A1B12(GND) USB1.B1A12(GND)
VCC: C16.1 C18.1 C19.1 CARD1.4(VDD) FPC1.14 FPC1.15 FPC2.15 FPC2.16 L1.1 Q4.3(D) R12.2 R14.1 R25.2 R30.1 R31.1 R32.1 SW1.2
BAT: BAT1.2 D5.2(A) Q1.3(D) R33.1 U1.5(BAT)
BAT_ADC: R19.1 R20.2 U8.4(SENSOR_VP)
BAT_ON: C2.2 POWER1.2 Q6.2(S) R19.2 R29.2 U2.1(VIN) U2.3(CE)
BTN_LEFT: R9.1 SW3.c SW3.d U8.8(IO32)
BTN_RIGHT: R10.1 SW3.f SW3.g U8.6(IO34)
BUZZER: R23.2 U8.10(IO25)
D+: U4.5(D+) USB1.A6(DP1) USB1.B6(DP2)
D-: U4.6(D-) USB1.A7(DN1) USB1.B7(DN2)
EPD_BUSY: FPC1.21 FPC2.9 U8.26(IO4)
EPD_CLK: CARD1.5(CLX) FPC1.17 FPC2.13 R14.2 U8.30(IO18)
EPD_CS: FPC1.18 FPC2.12 U8.29(IO5)
EPD_DC: FPC1.19 FPC2.11 U8.28(IO17)
EPD_DIN: CARD1.3(CMD) FPC1.16 FPC2.14 R31.2 U8.37(IO23)
EPD_RST: FPC1.20 FPC2.10 U8.27(IO16)
GDR: FPC1.28 FPC2.2 Q3.1(G) R7.2
I2C_SCL: R15.1 U5.3(SCL) U6.4(SCL) U7.2(SCL) U8.36(IO22) U9.7(SCL)
I2C_SDA: R18.1 U5.4(SDA) U6.1(SDA) U7.13(SDA) U8.33(IO21) U9.1(SDA)
IO0: BURN1.1 R11.1 SW3.e U4.13(DTR#) U8.25(IO0)
LIGHT_ADC: R28.2 U8.9(IO33) U9.2(INT)
LIGHT_CTRL: RHYTHM1.3(DI) U8.11(IO26)
MISO: CARD1.7(DAT0) R30.2 U8.31(IO19)
OUT: RHYTHM24.1(DO)
POWER_CTRL: Q4.1(G) R21.1 U8.12(IO27)
PREVGH: C12.1 D8.1(K) FPC1.9 FPC2.21
PREVGL: C14.1 D7.2(A) FPC1.7 FPC2.23
RESE: FPC1.27 FPC2.3 Q3.2(S) R8.2
RL_CTRL: Q6.1(G) R29.1 U8.13(IO14)
RTS: BURN1.2 R6.1 RESET1.1 U4.14(RTS#) U8.3(EN)
RXD0: BURN1.4 R17.1 U4.2(TXD) U8.34(U0RXD)
SD_SS: CARD1.2(CD/DAT3) R32.2 U8.23(IO15)
TXD0: BURN1.3 R16.1 U4.3(RXD) U8.35(U0TXD)
USB_ADC: R26.1 R27.2 U8.5(SENSOR_VN)
VOICE_ADC: Q5.3(C) R13.2 R25.1 U8.7(IO35)
Net-(BUZZER1-1): BUZZER1.1(+) R33.2
Net-(BUZZER1-2): BUZZER1.2(-) Q7.3(C)
Net-(C5-2): C5.2 C6.2 D5.1(K) U7.6(VDD)
Net-(C7-1): C7.1 FPC1.26 FPC2.4
Net-(C8-1): C8.1 FPC1.25 FPC2.5
Net-(C9-1): C9.1 FPC1.12 FPC2.18
Net-(C10-1): C10.1 FPC1.11 FPC2.19
Net-(C11-1): C11.1 FPC1.10 FPC2.20
Net-(C13-1): C13.1 FPC1.8 FPC2.22
Net-(C15-1): C15.1 FPC1.6 FPC2.24
Net-(C17-1): C17.1 D6.2(A) D7.1(K)
Net-(C17-2): C17.2 D8.2(A) L1.2 Q3.3(D)
Net-(C20-1): C20.1 MIC1.1 R12.1
Net-(C20-2): C20.2 Q5.1(B) R13.1
Net-(CHRG1-1): CHRG1.1(A) DONE1.1(A) R4.1
Net-(CHRG1-2): CHRG1.2(C) U1.7(CHRG)
Net-(D4-1): D4.1(C) POWER1.3 Q1.2(S)
Net-(DONE1-2): DONE1.2(C) U1.6(STDBY)
Net-(Q2-3): Q2.3(D) U4.1(GND)
Net-(Q6-3): Q6.3(D) RHYTHM1.4(VDD) RHYTHM2.4(VDD) RHYTHM3.4(VDD) RHYTHM4.4(VDD) RHYTHM5.4(VDD) RHYTHM6.4(VDD) RHYTHM7.4(VDD) RHYTHM8.4(VDD) RHYTHM9.4(VDD) RHYTHM10.4(VDD) RHYTHM11.4(VDD) RHYTHM12.4(VDD) RHYTHM13.4(VDD) RHYTHM14.4(VDD) RHYTHM15.4(VDD) RHYTHM16.4(VDD) RHYTHM17.4(VDD) RHYTHM18.4(VDD) RHYTHM19.4(VDD) RHYTHM20.4(VDD) RHYTHM21.4(VDD) RHYTHM22.4(VDD) RHYTHM23.4(VDD) RHYTHM24.4(VDD)
Net-(Q7-1): Q7.1(B) R22.2 R23.1
Net-(R1-2): R1.2 USB1.A5(CC1) USB1.B5(CC2)
Net-(R3-2): R3.2 U1.2(PROG)
Net-(RHYTHM1-1): RHYTHM1.1(DO) RHYTHM2.3(DI)
Net-(RHYTHM2-1): RHYTHM2.1(DO) RHYTHM3.3(DI)
Net-(RHYTHM3-1): RHYTHM3.1(DO) RHYTHM4.3(DI)
Net-(RHYTHM4-1): RHYTHM4.1(DO) RHYTHM5.3(DI)
Net-(RHYTHM5-1): RHYTHM5.1(DO) RHYTHM6.3(DI)
Net-(RHYTHM6-1): RHYTHM6.1(DO) RHYTHM7.3(DI)
Net-(RHYTHM7-1): RHYTHM7.1(DO) RHYTHM8.3(DI)
Net-(RHYTHM8-1): RHYTHM8.1(DO) RHYTHM9.3(DI)
Net-(RHYTHM9-1): RHYTHM9.1(DO) RHYTHM10.3(DI)
Net-(RHYTHM10-1): RHYTHM10.1(DO) RHYTHM11.3(DI)
Net-(RHYTHM11-1): RHYTHM11.1(DO) RHYTHM12.3(DI)
Net-(RHYTHM12-1): RHYTHM12.1(DO) RHYTHM13.3(DI)
Net-(RHYTHM13-1): RHYTHM13.1(DO) RHYTHM14.3(DI)
Net-(RHYTHM14-1): RHYTHM14.1(DO) RHYTHM15.3(DI)
Net-(RHYTHM15-1): RHYTHM15.1(DO) RHYTHM16.3(DI)
Net-(RHYTHM16-1): RHYTHM16.1(DO) RHYTHM17.3(DI)
Net-(RHYTHM17-1): RHYTHM17.1(DO) RHYTHM18.3(DI)
Net-(RHYTHM18-1): RHYTHM18.1(DO) RHYTHM19.3(DI)
Net-(RHYTHM19-1): RHYTHM19.1(DO) RHYTHM20.3(DI)
Net-(RHYTHM20-1): RHYTHM20.1(DO) RHYTHM21.3(DI)
Net-(RHYTHM21-1): RHYTHM21.1(DO) RHYTHM22.3(DI)
Net-(RHYTHM22-1): RHYTHM22.1(DO) RHYTHM23.3(DI)
Net-(RHYTHM23-1): RHYTHM23.1(DO) RHYTHM24.3(DI)
Net-(U9-3): U9.3(LDR) U9.4(LED K)

Not connected (* = marked no-connect by the designer): CARD1 1(DAT2)* 8(DAT1)* 9(CD)*; FPC1 1* 2* 3* 4* 5* 23* 24* 29* 30* 31* 32* 33* 34*; FPC2 1* 6* 7*; POWER1 1*; U2 4(NC)*; U4 7(NC.)* 8(NC.)* 9(CTS#)* 10(DSR#)* 11(RI#)* 12(DCD#)* 15(R232)*; U5 1(NC)* 6(NC)*; U6 3(ALERT)* 6(nRESET)*; U7 1(T1)* 3(FOUT)* 4(NC)* 5(TEST)* 8(NC)* 9(NC)* 10(INT#)* 12(T2)* 14(NC)*; U8 14(IO12)* 16(IO13)* 17(SD2)* 18(SD3)* 19(CMD)* 20(CLK)* 21(SDO)* 22(SDI)* 24(IO2)* 32(NC)*; USB1 A8(SBU1)* B8(SBU2)*

## Notes on the sheet
- ADC
- 下载电路
- 充电及稳压模块
- 温湿度芯片
- 时钟芯片
- 插USB时自动启用
- 支持AHT20、SHT30(GHT30)
- 两种芯片仅需焊接一种即可
- C5为1206贴片位置，备用，方便选择更大
  贴片电容，延长时间保持时长因时钟芯片是
  电池直接供电，所以如果是测试需要接电池
  或插USB才能正常
- CH340C本身输出的就是低电平，所以
  不需要再额外加下载电路(实测可用)
- U2 ME6217C33M5G 最大电流 800m(推荐)
  兼容以下型号
  XC6210B332 最大电流 700mA
  ME6211C33M5G 最大电流 500mA
  RT9013-33GB 最大电流 500mA
- 无源蜂鸣器
- 外接烧录座
- 没有CH340C时也可以使用其它TTL烧录
  其它TTL烧录没有DTR和RTS也没有关系，
  只是不能自动下载，需要手动按方向中键及复位键
- 方向键
- 环境光测光部分
- 音频采集
- 其它供电控制
- 墨水屏驱动
- 根据自己屏幕排线选择焊24P或34P
- SW不用焊，测试用
- ESP32主芯片
- 灯光控制--律动灯效
- TF卡驱动
